# Altium schematic sheet Sheet2.SchDoc: RBCM_Mother
size 419 x 297 mm; SheetNumber: 2; SheetTotal: 3; SCH_SCALE: Not to Scale; PrjRev: A; DocRev: A; Team: WUTE Racing Team
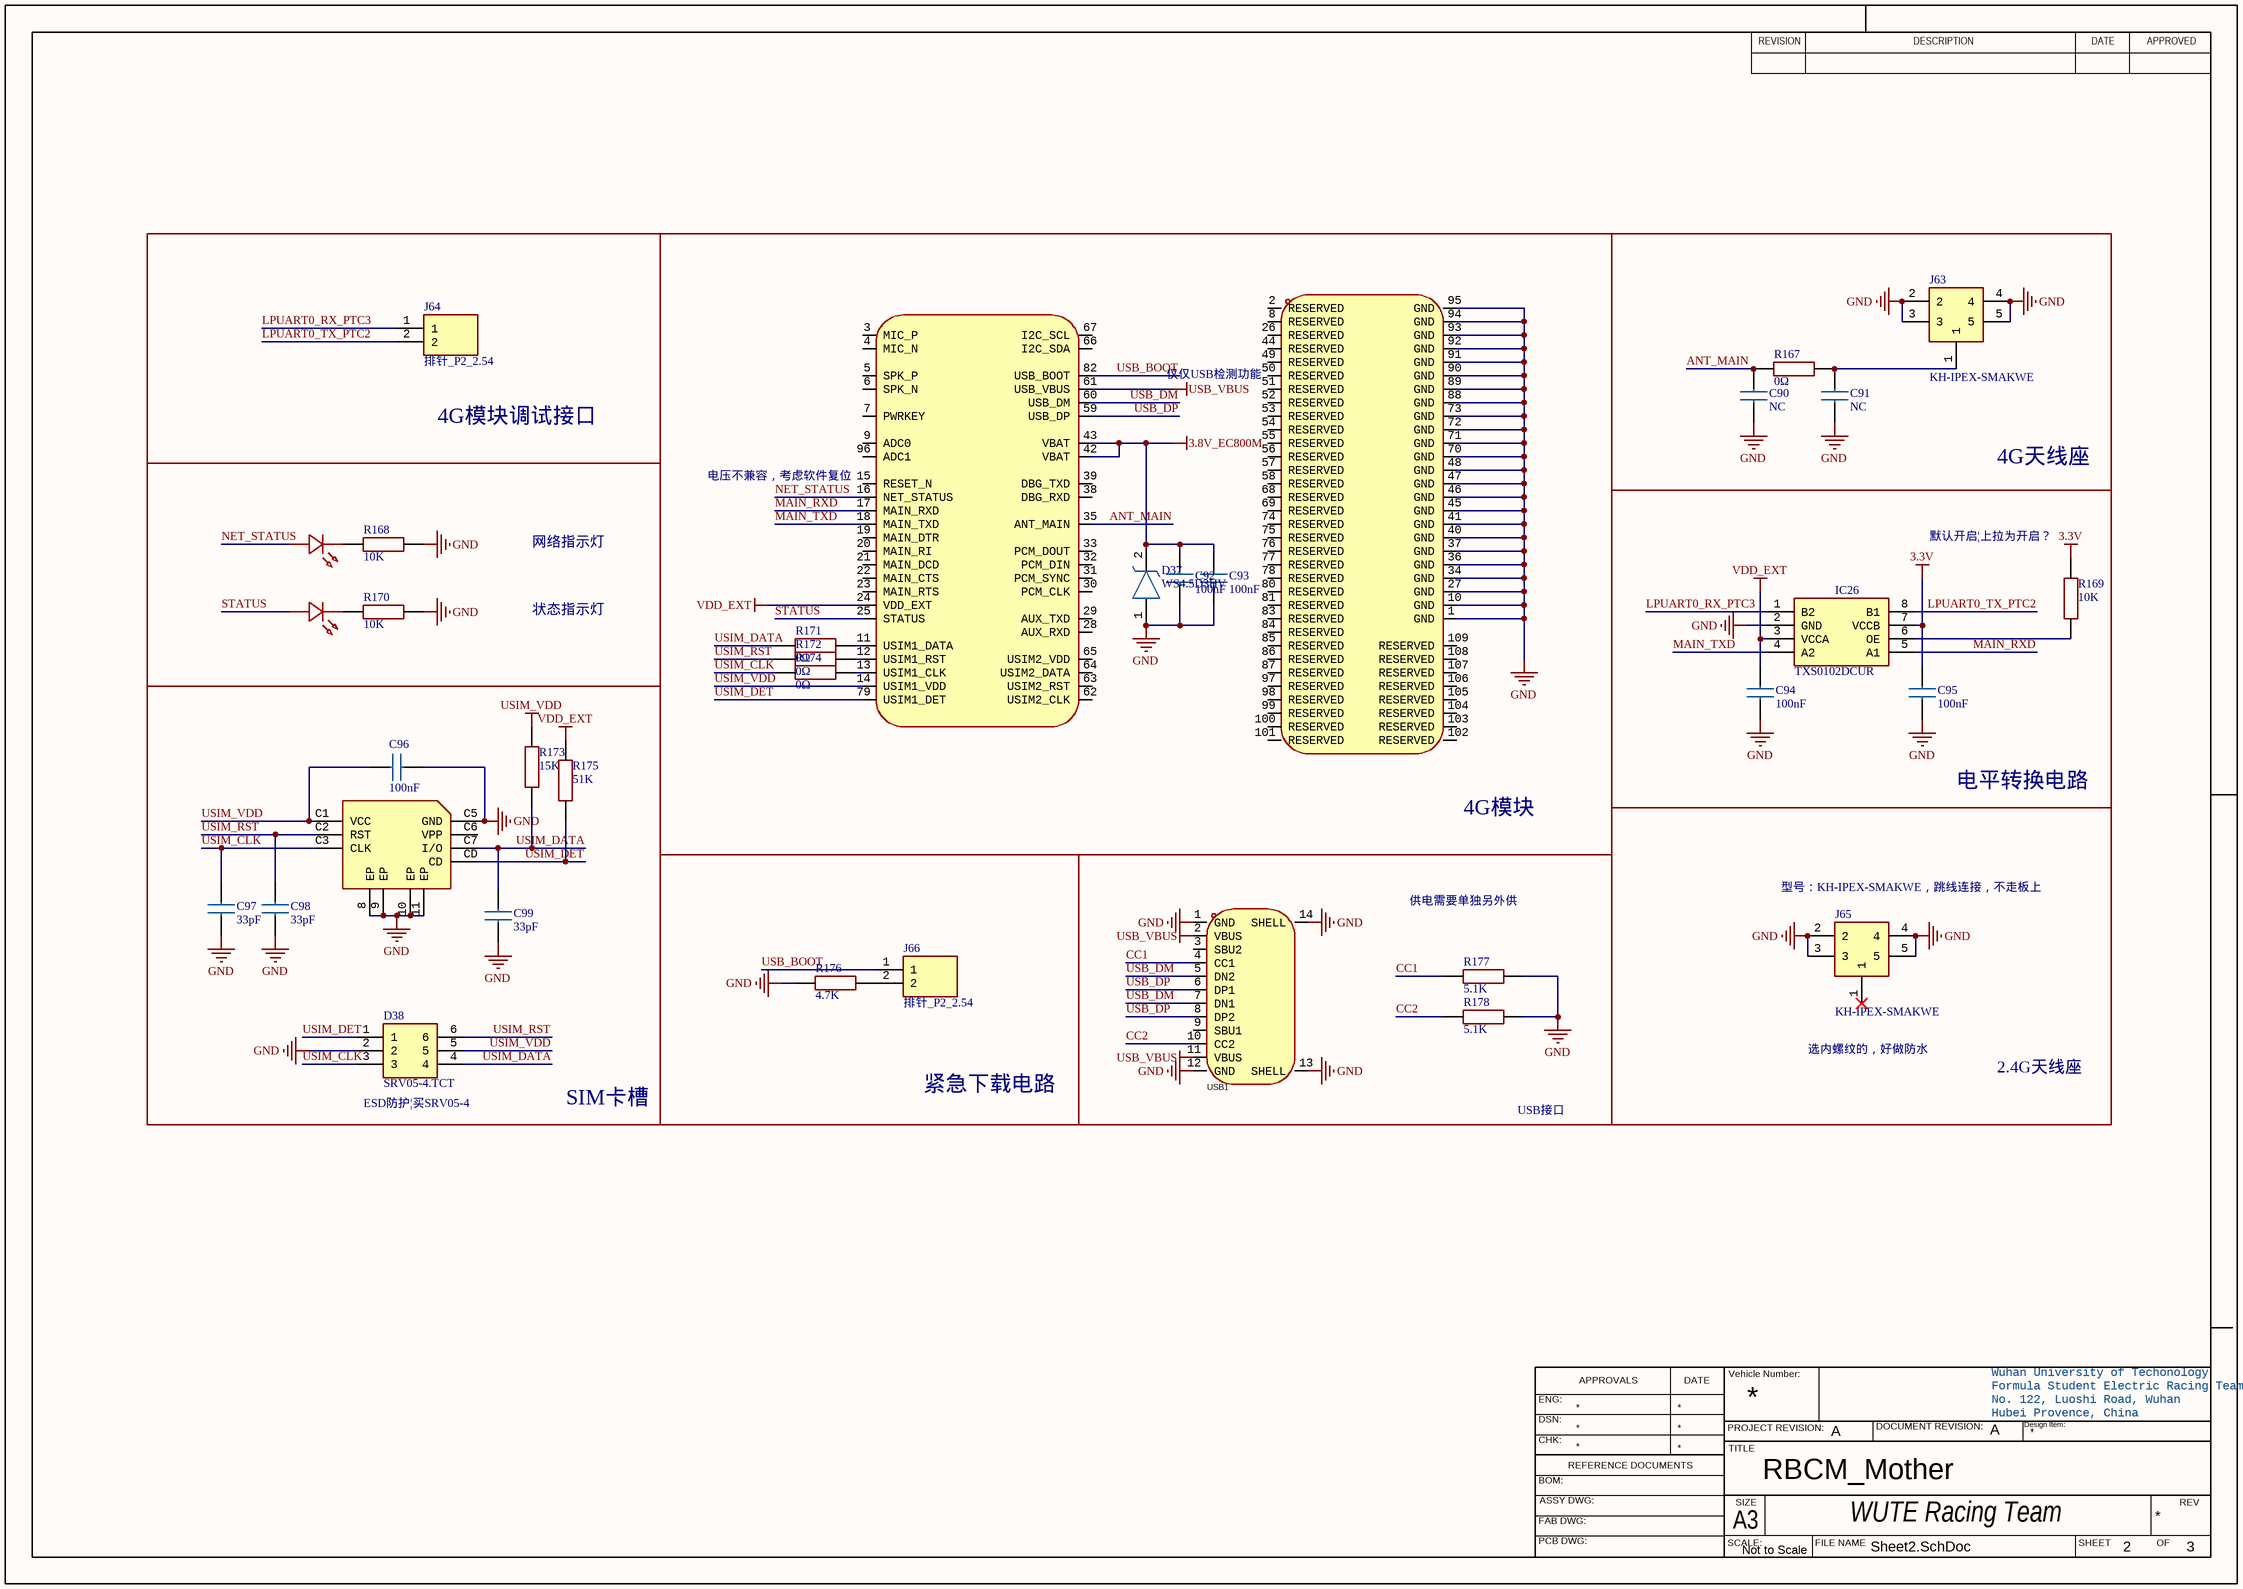
[diagram p0: Sheet2.SchDoc]

## Parts
C90  NC  [CAPC1608X90N]
C91  NC  [CAPC1608X90N]
C92  100nF  [CAPC1608X90N]
C93  100nF  [CAPC1608X90N]
C94  100nF  [CAPC1608X90N]
C95  100nF  [CAPC1608X90N]
C96  100nF  [CAPC1608X90N]
C97  33pF  [CAPC1608X90N]
C98  33pF  [CAPC1608X90N]
C99  33pF  [CAPC1608X90N]
CARD1  SMN-303  [SIM-SMD_SMN-303]  (value not drawn)
D37  WS4.5D3HV  [WS45D3HV]
D38  SRV05-4.TCT  [SOT95P280X145-6N]
IC26  TXS0102DCUR  [SOP50P310X90-8N]
J63  KH-IPEX-SMAKWE  [KHIPEXSMAKWE]
J64  排针_P2_2.54  [HDRV2W66P0X254_1X2_508X250X880P]
J65  KH-IPEX-SMAKWE  [KHIPEXSMAKWE]
J66  排针_P2_2.54  [HDRV2W66P0X254_1X2_508X250X880P]
LED3  XL-1606UGC  [LED-SMD_L1.7-W1.1-R-RD_GREEN]  (value not drawn)
LED4  XL-1606UGC  [LED-SMD_L1.7-W1.1-R-RD_GREEN]  (value not drawn)
R167  0Ω  [RESC1608X55N]
R168  10K  [RESC1608X55N]
R169  10K  [RESC1608X55N]
R170  10K  [RESC1608X55N]
R171  0Ω  [RESC1608X55N]
R172  0Ω  [RESC1608X55N]
R173  15K  [RESC1608X55N]
R174  0Ω  [RESC1608X55N]
R175  51K  [RESC1608X55N]
R176  4.7K  [RESC1608X55N]
R177  5.1K  [RESC1608X55N]
R178  5.1K  [RESC1608X55N]
U2  EC800MCNGA-I05-SGNSA  [LCC-109_L17.7-W15.8-P1.10_EC800M-CN]  (value not drawn)  (parts A,B of 2)
USB1  TYPE-C 16PIN 2MD(073)  [USB-C-SMD_TYPE-C-6PIN-2MD-073]  (value not drawn)

## Blocks framed on the sheet
4G模块调试接口: J64
4G模块: C92 C93 D37 R171 R172 R174 U2
4G天线座: C90 C91 J63 R167
默认开启¦上拉为开启？: C94 C95 IC26 R169
SIM卡槽: C96-C99 CARD1 D38 R173 R175
紧急下载电路: J66 R176
电平转换电路: J65

## Nets
3.3V: C95.1 IC26.7(VCCB) R169.1
3.8V_EC800M: C92.2 C93.2 D37.2(K) U2.42(VBAT) U2.43(VBAT)
GND: C90.1 C91.1 C92.1 C93.1 C94.2 C95.2 C96.1 C97.2 C98.2 C99.2 CARD1.8(EP) CARD1.9(EP) CARD1.10(EP) CARD1.11(EP) CARD1.C5(GND) D37.1(A) D38.2 IC26.2(GND) J63.2 J63.3 J63.4 J63.5 J65.2 J65.3 J65.4 J65.5 R168.1 R170.1 R176.1 R177.2 R178.2 U2.1(GND) U2.10(GND) U2.27(GND) U2.34(GND) U2.36(GND) U2.37(GND) U2.40(GND) U2.41(GND) U2.45(GND) U2.46(GND) U2.47(GND) U2.48(GND) U2.70(GND) U2.71(GND) U2.72(GND) U2.73(GND) U2.88(GND) U2.89(GND) U2.90(GND) U2.91(GND) U2.92(GND) U2.93(GND) U2.94(GND) U2.95(GND) USB1.1(GND) USB1.12(GND) USB1.13(SHELL) USB1.14(SHELL)
USB_VBUS: U2.61(USB_VBUS) USB1.2(VBUS) USB1.11(VBUS)
USIM_VDD: C96.2 CARD1.C1(VCC) D38.5 R173.2 U2.14(USIM1_VDD)
VDD_EXT: C94.1 IC26.3(VCCA) R175.2 U2.24(VDD_EXT)
ANT_MAIN: C90.2 R167.1 U2.35(ANT_MAIN)
CC1: R177.1 USB1.4(CC1)
CC2: R178.1 USB1.10(CC2)
LPUART0_RX_PTC3: IC26.1(B2) J64.1
LPUART0_TX_PTC2: IC26.8(B1) J64.2
MAIN_RXD: IC26.5(A1) U2.17(MAIN_RXD)
MAIN_TXD: IC26.4(A2) U2.18(MAIN_TXD)
NET_STATUS: LED3.1(A) U2.16(NET_STATUS)
STATUS: LED4.1(A) U2.25(STATUS)
USB_BOOT: J66.1 U2.82(USB_BOOT)
USB_DM: U2.60(USB_DM) USB1.5(DN2) USB1.7(DN1)
USB_DP: U2.59(USB_DP) USB1.6(DP1) USB1.8(DP2)
USIM_CLK: C97.1 CARD1.C3(CLK) D38.3 R174.1
USIM_DATA: C99.1 CARD1.C7(I/O) D38.4 R171.1 R173.1
USIM_DET: CARD1.CD D38.1 R175.1 U2.79(USIM1_DET)
USIM_RST: C98.1 CARD1.C2(RST) D38.6 R172.1
NetC91_2: C91.2 J63.1 R167.2
NetIC26_6: IC26.6(OE) R169.2
NetJ66_2: J66.2 R176.2
NetLED3_2: LED3.2(K) R168.2
NetLED4_2: LED4.2(K) R170.2
NetR171_2: R171.2 U2.11(USIM1_DATA)
NetR172_2: R172.2 U2.12(USIM1_RST)
NetR174_2: R174.2 U2.13(USIM1_CLK)

Not connected (* = marked no-connect by the designer): CARD1 C6(VPP); J65 1*; U2 2(RESERVED) 3(MIC_P) 4(MIC_N) 5(SPK_P) 6(SPK_N) 7(PWRKEY) 8(RESERVED) 9(ADC0) 15(RESET_N) 19(MAIN_DTR) 20(MAIN_RI) 21(MAIN_DCD) 22(MAIN_CTS) 23(MAIN_RTS) 26(RESERVED) 28(AUX_RXD) 29(AUX_TXD) 30(PCM_CLK) 31(PCM_SYNC) 32(PCM_DIN) 33(PCM_DOUT) 38(DBG_RXD) 39(DBG_TXD) 44(RESERVED) 49(RESERVED) 50(RESERVED) 51(RESERVED) 52(RESERVED) 53(RESERVED) 54(RESERVED) 55(RESERVED) 56(RESERVED) 57(RESERVED) 58(RESERVED) 62(USIM2_CLK) 63(USIM2_RST) 64(USIM2_DATA) 65(USIM2_VDD) 66(I2C_SDA) 67(I2C_SCL) 68(RESERVED) 69(RESERVED) 74(RESERVED) 75(RESERVED) 76(RESERVED) 77(RESERVED) 78(RESERVED) 80(RESERVED) 81(RESERVED) 83(RESERVED) 84(RESERVED) 85(RESERVED) 86(RESERVED) 87(RESERVED) 96(ADC1) 97(RESERVED) 98(RESERVED) 99(RESERVED) 100(RESERVED) 101(RESERVED) 102(RESERVED) 103(RESERVED) 104(RESERVED) 105(RESERVED) 106(RESERVED) 107(RESERVED) 108(RESERVED) 109(RESERVED); USB1 3(SBU2) 9(SBU1)

## Notes on the sheet
- 仅仅USB检测功能
- 电压不兼容，考虑软件复位
- 网络指示灯
- 状态指示灯
- 供电需要单独另外供
- (near J65) 型号：KH-IPEX-SMAKWE，跳线连接，不走板上
- 选内螺纹的，好做防水
- 2.4G天线座
- (near D38) ESD防护¦买SRV05-4
- USB接口
- REVISION
- DESCRIPTION
- DATE
- APPROVED
- ENG:
- APPROVALS
- Vehicle Number:
- Wuhan University of Techonology
- Formula Student Electric Racing Team
- No. 122, Luoshi Road, Wuhan
- DSN:
- CHK:
- REFERENCE DOCUMENTS
- PROJECT REVISION:
- TITLE
- DOCUMENT REVISION:
- Hubei Provence, China
- Design Item:
- BOM:
- FAB DWG:
- PCB DWG:
- ASSY DWG:
- SCALE:
- A3
- SIZE
- FILE NAME
- SHEET
- OF
- REV

## Library data of the parts
C90-C93 C96-C99 = C0603: Capacitor; Manufacturer_Name: YAGEO; Manufacturer_Part_Number: CC0603KRX7R9BB104; Datasheet Link: https://componentsearchengine.com/Datasheets/2/CC0603KRX7R9BB104.pdf; Height: 0.9mm; Mouser Part Number: 603-CC603KRX7R9BB104; Mouser Price/Stock: https://www.mouser.co.uk/ProductDetail/YAGEO/CC0603KRX7R9BB104?qs=vTakOoo5QyLvVCYM2ge8LQ%3D%3D; Arrow Part Number: CC0603KRX7R9BB104; Arrow Price/Stock: https://www.arrow.com/en/products/cc0603krx7r9bb104/yageo?region=europe
C94 C95 = C0603: Capacitor CC0603KRX7R9BB104; Manufacturer_Name: YAGEO; Datasheet Link: https://componentsearchengine.com/Datasheets/2/CC0603KRX7R9BB104.pdf; Height: 0.9mm; Manufacturer_Part_Number: CC0603KRX7R9BB104; Mouser Part Number: 603-CC603KRX7R9BB104; Mouser Price/Stock: https://www.mouser.co.uk/ProductDetail/YAGEO/CC0603KRX7R9BB104?qs=vTakOoo5QyLvVCYM2ge8LQ%3D%3D; Arrow Part Number: CC0603KRX7R9BB104; Arrow Price/Stock: https://www.arrow.com/en/products/cc0603krx7r9bb104/yageo?region=europe
CARD1 = SMN-303: Manufacturer: XUNPU(讯普); Add into BOM: yes; Card Connection Mode: 自弹式; Card Type: NanoSIM卡; Connector Type: 卡座; Card Detection: 有插卡检测; Body Height (Max): 1.37mm; Symbol: SMN-303; Device: SMN-303; LCSC Part Name: 自弹式 NanoSIM卡 卡座; Supplier Part: C266888; Manufacturer Part: SMN-303; Supplier Footprint: SMD; JLCPCB Part Class: Extended Part; Datasheet: https://atta.szlcsc.com/upload/public/pdf/source/20230608/69FA23A73293DEADC31E393DD83871F4.pdf; Supplier: LCSC; Convert to PCB: yes; Supplementary Features: -; Operating Temperature Range: -40℃~+85℃
D37 = WS4.5D3HV: TVS Diode (Uni-directional); Manufacturer_Name: Way-On; Datasheet Link: https://www.way-on.com/upload/201807/31/201807311326214442.pdf; Height: 0.7mm; Manufacturer_Part_Number: WS4.5D3HV
D38 = SRV05-4.TCT: TVS Diode (Uni-directional); Manufacturer_Name: SEMTECH; Datasheet Link: https://datasheet.datasheetarchive.com/originals/distributors/Datasheets-DGA26/1842016.pdf; Height: 1.45mm; Manufacturer_Part_Number: SRV05-4.TCT; Mouser Part Number: 947-SRV05-4.TCT; Mouser Price/Stock: https://www.mouser.co.uk/ProductDetail/Semtech/SRV05-4.TCT?qs=rBWM4%252BvDhIe0tfPjqKjR5Q%3D%3D; Arrow Part Number: SRV05-4.TCT; Arrow Price/Stock: https://www.arrow.com/en/products/srv05-4.tct/semtech?utm_currency=USD&region=nac
IC26 = TXS0102DCUR: Integrated Circuit; Manufacturer_Name: Texas Instruments; Datasheet Link: https://datasheet.datasheetarchive.com/originals/distributors/SFDatasheet-7/sf-000145437.pdf; Height: 0.9mm; Manufacturer_Part_Number: TXS0102DCUR; Mouser Part Number: 595-TXS0102DCUR; Mouser Price/Stock: https://www.mouser.co.uk/ProductDetail/Texas-Instruments/TXS0102DCUR?qs=dB0LedT%252BmmBcQ3I%2Fs9XEDA%3D%3D; Arrow Part Number: TXS0102DCUR; Arrow Price/Stock: https://www.arrow.com/en/products/txs0102dcur/texas-instruments?utm_currency=USD&region=nac
J63 J65 = KH-IPEX-SMAKWE: Connector; Manufacturer_Name: Shenzhen Kinghelm Elec; Datasheet Link: https://amel.ru/upload/iblock/99e/SMA-KWHD.pdf; Height: 9.7mm; Manufacturer_Part_Number: KH-IPEX-SMAKWE
J64 J66 = 排针_P2_2.54: Connector; Manufacturer_Name: Ckmtw(Shenzhen Cankemeng); Manufacturer_Part_Number: B-2100S02P-A110; Datasheet Link: https://datasheet.lcsc.com/lcsc/2210192330_Ckmtw-Shenzhen-Cankemeng-B-2100S02P-A110_C124375.pdf; Height: 8.8mm
LED3 LED4 = XL-1606UGC: Manufacturer: XINGLIGHT(成兴光); Add into BOM: yes; Emitted Color: 翠绿色; Power Dissipation: 80mW; Forward Current: 25mA; Dominant Wavelength: 520nm~530nm; Peak Wavelength: 535nm; Lens Color: 无色透明透镜; Viewing Angle: 120°; Mounting Sytle: 侧贴; Symbol: XL-1606UGC; Device: XL-1606UGC; LCSC Part Name: XL-1606UGC; Supplier Part: C965863; Manufacturer Part: XL-1606UGC; Supplier Footprint: SMD,1.1x1.7mm; JLCPCB Part Class: Extended Part; Datasheet: https://atta.szlcsc.com/upload/public/pdf/source/20221102/94FA3AB05D9E652787BBD0AFAAE97065.pdf; Supplier: LCSC; Convert to PCB: yes; Color Temperature: -; Operating Temperature: -30℃~+85℃
R167 R168 R170-R176 = R0603: Resistor; Manufacturer_Name: UNI-ROYAL(Uniroyal Elec); Manufacturer_Part_Number: 0603WAF1002T5E; Datasheet Link: https://datasheet.lcsc.com/szlcsc/Uniroyal-Elec-0603WAF1002T5E_C25804.pdf; Height: 0.55mm
R169 R177 R178 = R0603: Resistor 0603WAF1002T5E; Manufacturer_Name: UNI-ROYAL(Uniroyal Elec); Datasheet Link: https://datasheet.lcsc.com/szlcsc/Uniroyal-Elec-0603WAF1002T5E_C25804.pdf; Height: 0.55mm; Manufacturer_Part_Number: 0603WAF1002T5E
U2 = EC800MCNGA-I05-SGNSA: Manufacturer: Quectel(移远); Add into BOM: yes; Symbol: EC800MCNGA-I05-SGNSA; Device: EC800MCNGA-I05-SGNSA; LCSC Part Name: LTE Standard 模块 停产; Supplier Part: C5200736; Manufacturer Part: EC800MCNGA-I05-SGNSA; Supplier Footprint: SMD,15.8x17.7mm; JLCPCB Part Class: Extended Part; Datasheet: https://atta.szlcsc.com/upload/public/pdf/source/20221128/3247853C8E24B9EB0EE07D4BC508718A.pdf; Supplier: LCSC; Convert to PCB: yes
USB1 = TYPE-C 16PIN 2MD(073): Manufacturer: SHOU HAN(首韩); Add into BOM: yes; Gender: 母; Number of Contacts: 16P; Number of Ports: 1; Current Rating - Power (Max): 5A; Rated Voltage (Max): 5V; Connect-Disconnect Life: 5千次; Core Colour: 黑色; Symbol: TYPE-C 16PIN 2MD(073); Device: TYPE-C 16PIN 2MD(073); LCSC Part Name: Type-C 母 卧贴; Supplier Part: C2765186; Manufacturer Part: TYPE-C 16PIN 2MD(073); Supplier Footprint: SMD; JLCPCB Part Class: Extended Part; Datasheet: https://atta.szlcsc.com/upload/public/pdf/source/20211123/39B17C16241EAC15C5E277BDA434118E.pdf; Supplier: LCSC; Convert to PCB: yes; Connector Type: Type-C; Standard: USB 3.1; Mounting Style: 卧贴; Operating Temperature Range: -25℃~+85℃